# EAGLE design NQSMHS-V3 (EAGLE 7.7.0)

## Sheet 1 of 4
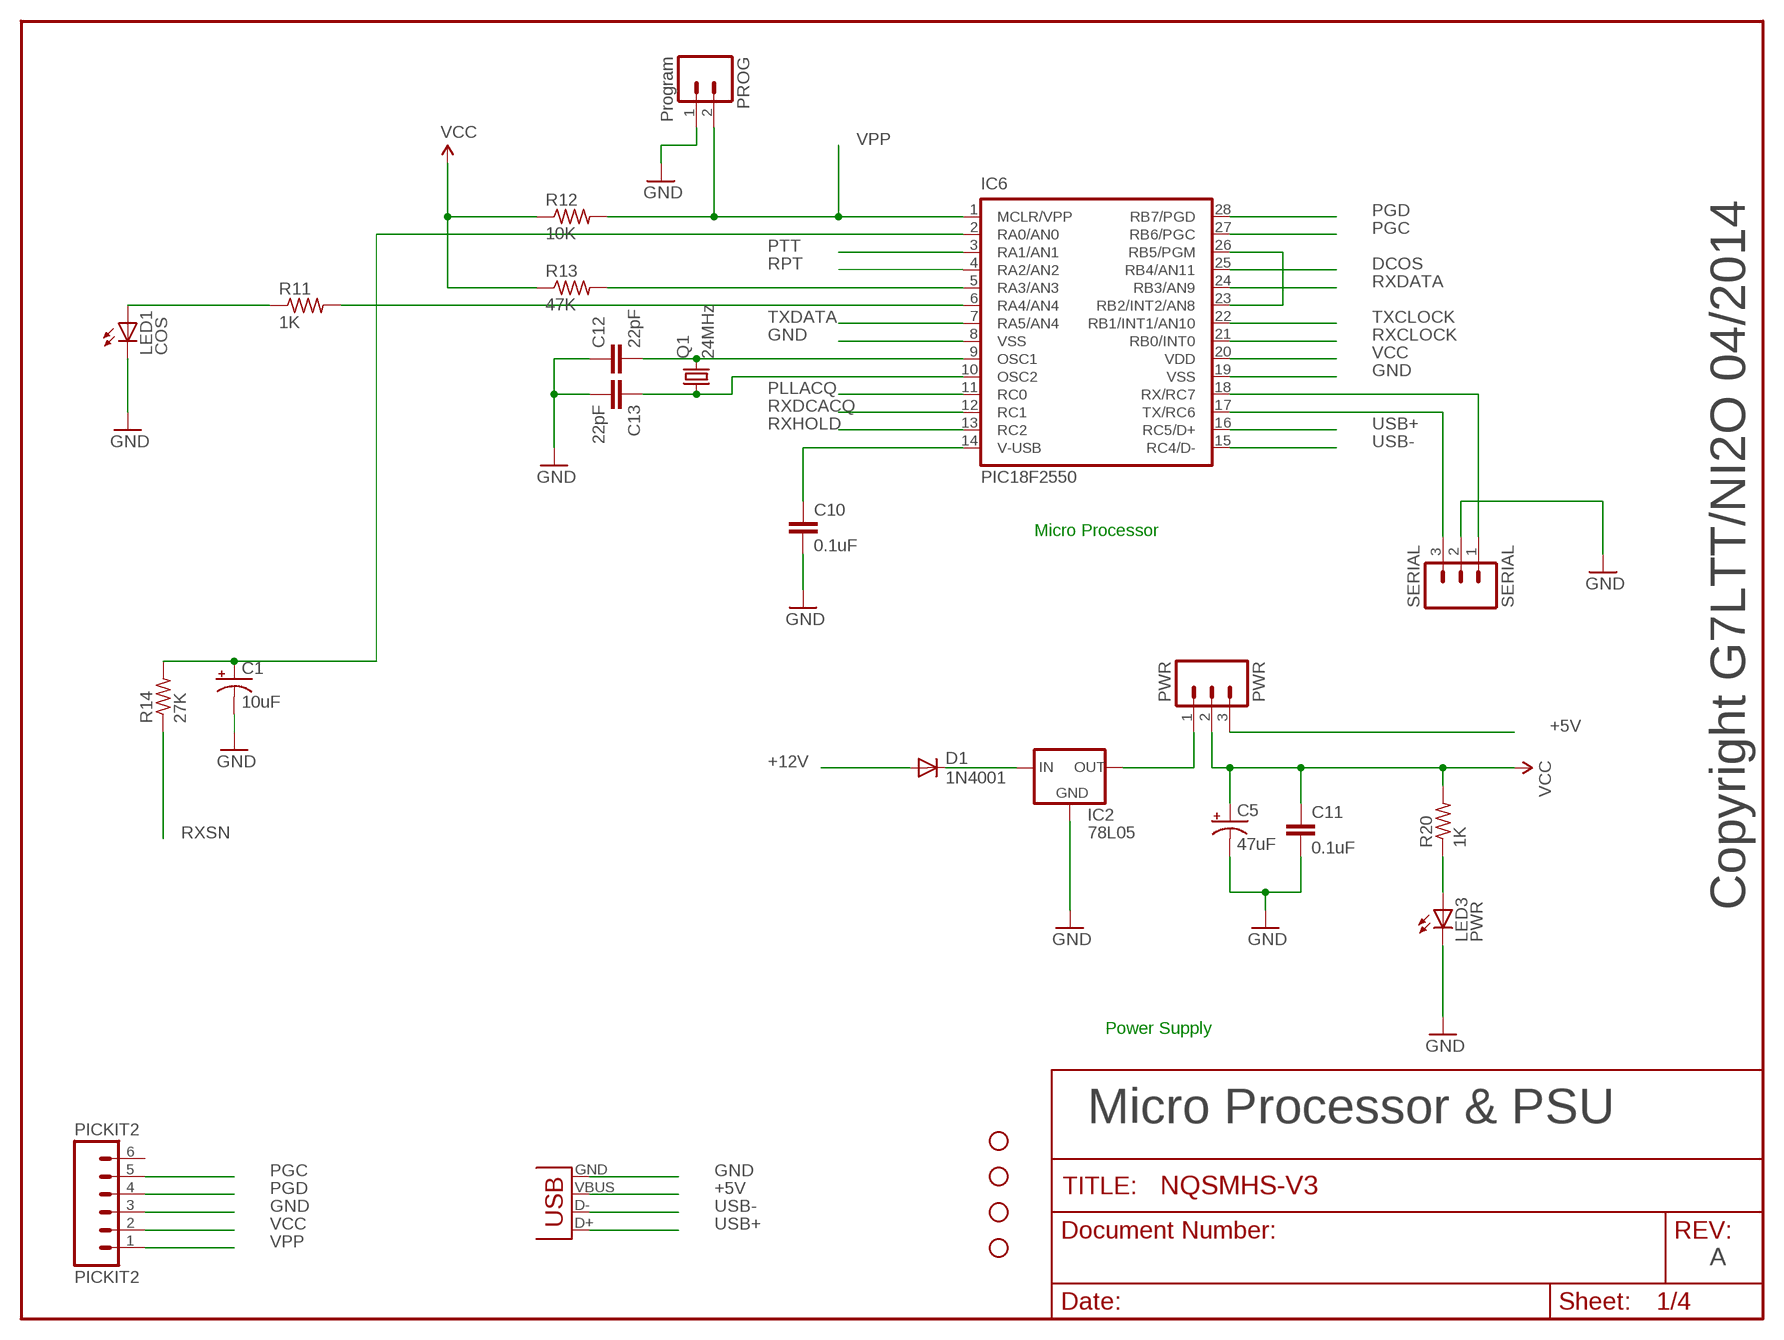
[diagram p0: schematic, sheet 1]

### Parts
C1  10uF  CAP_POLPTH2  [CPOL-RADIAL-10UF-25V]
C5  47uF  CAP_POLPTH2  [CPOL-RADIAL-10UF-25V]
C10  0.1uF  C2.5/2  [C2.5-2]
C11  0.1uF  C2.5/2  [C2.5-2]
C12  22pF  C2.5/2  [C2.5-2]
C13  22pF  C2.5/2  [C2.5-2]
D1  1N4001  DIODEPTH  [DIODE-1N4001]
IC2  78L05  78LXX  [78LXX]
IC6  PIC18F2550  [DIL28-3]
J1  USBPTH  [USB-B-PTH]
JP7  STAND-OFF  [STAND-OFF]
JP8  STAND-OFF  [STAND-OFF]
JP9  STAND-OFF  [STAND-OFF]
JP10  STAND-OFF  [STAND-OFF]
LED1  COS  LED3MM  [LED3MM]
LED3  PWR  LED3MM  [LED3MM]
PICKIT2  PICKIT2  M06SIP  [1X06]
PROG  Program  M02PTH  [1X02]
PWR  PWR  M03PTH  [1X03]
Q1  24MHz  CRYSTALHC49US  [HC49US]
R11  1K  R-US_0207/2V  [0207/2V]
R12  10K  R-US_0207/2V  [0207/2V]
R13  47K  R-US_0207/2V  [0207/2V]
R14  27K  R-US_0207/2V  [0207/2V]
R20  1K  R-US_0207/2V  [0207/2V]
SERIAL  SERIAL  M03PTH  [1X03]

### Nets
+5V: J1.VBUS PWR.3
+12V: D1.A ; also sheet 2
DCOS: IC6.25(RB4/AN11) ; also sheet 3
GND: C1.2(-) C5.2(-) C10.2 C11.2 C12.1 C13.2 IC2.GND IC6.8(VSS) IC6.19(VSS) J1.GND LED1.K(C) LED3.K(C) PICKIT2.3 PROG.1 SERIAL.2 ; also sheet 2,3,4
N$2: D1.C IC2.IN
N$3: IC6.23(RB2/INT2/AN8) IC6.26(RB5/PGM)
N$4: IC6.5(RA3/AN3) R13.2
N$5: IC6.6(RA4/AN4) R11.2
N$6: LED1.A R11.1
N$9: C12.2 IC6.9(OSC1) Q1.2
N$10: C13.1 IC6.10(OSC2) Q1.1
N$11: C10.1 IC6.14(V-USB)
N$12: IC2.OUT PWR.1
N$13: LED3.A R20.1
PGC: IC6.27(RB6/PGC) PICKIT2.5
PGD: IC6.28(RB7/PGD) PICKIT2.4
PLLACQ: IC6.11(RC0) ; also sheet 4
PTT: IC6.3(RA1/AN1) ; also sheet 2
RPT: IC6.4(RA2/AN2)
RX-232: IC6.18(RX/RC7) SERIAL.1
RXCLOCK: IC6.21(RB0/INT0) ; also sheet 4
RXDATA: IC6.24(RB3/AN9) ; also sheet 4
RXDCACQ: IC6.12(RC1) ; also sheet 4
RXHOLD: IC6.13(RC2) ; also sheet 4
RXSN: R14.1 ; also sheet 3,4
TX-232: IC6.17(TX/RC6) SERIAL.3
TX/SN: C1.1(+) IC6.2(RA0/AN0) R14.2
TXCLOCK: IC6.22(RB1/INT1/AN10) ; also sheet 4
TXDATA: IC6.7(RA5/AN4) ; also sheet 4
USB+: IC6.16(RC5/D+) J1.D+
USB-: IC6.15(RC4/D-) J1.D-
VCC: C5.1(+) C11.1 IC6.20(VDD) PICKIT2.2 PWR.2 R12.1 R13.1 R20.2 ; also sheet 2,3,4
VPP: IC6.1(MCLR/VPP) PICKIT2.1 PROG.2 R12.2
Unconnected: PICKIT2.6

### Notes on the sheet
- Micro Processor
- Copyright G7LTT/NI2O 04/2014
- Power Supply
- Micro Processor & PSU
- A

## Sheet 2 of 4
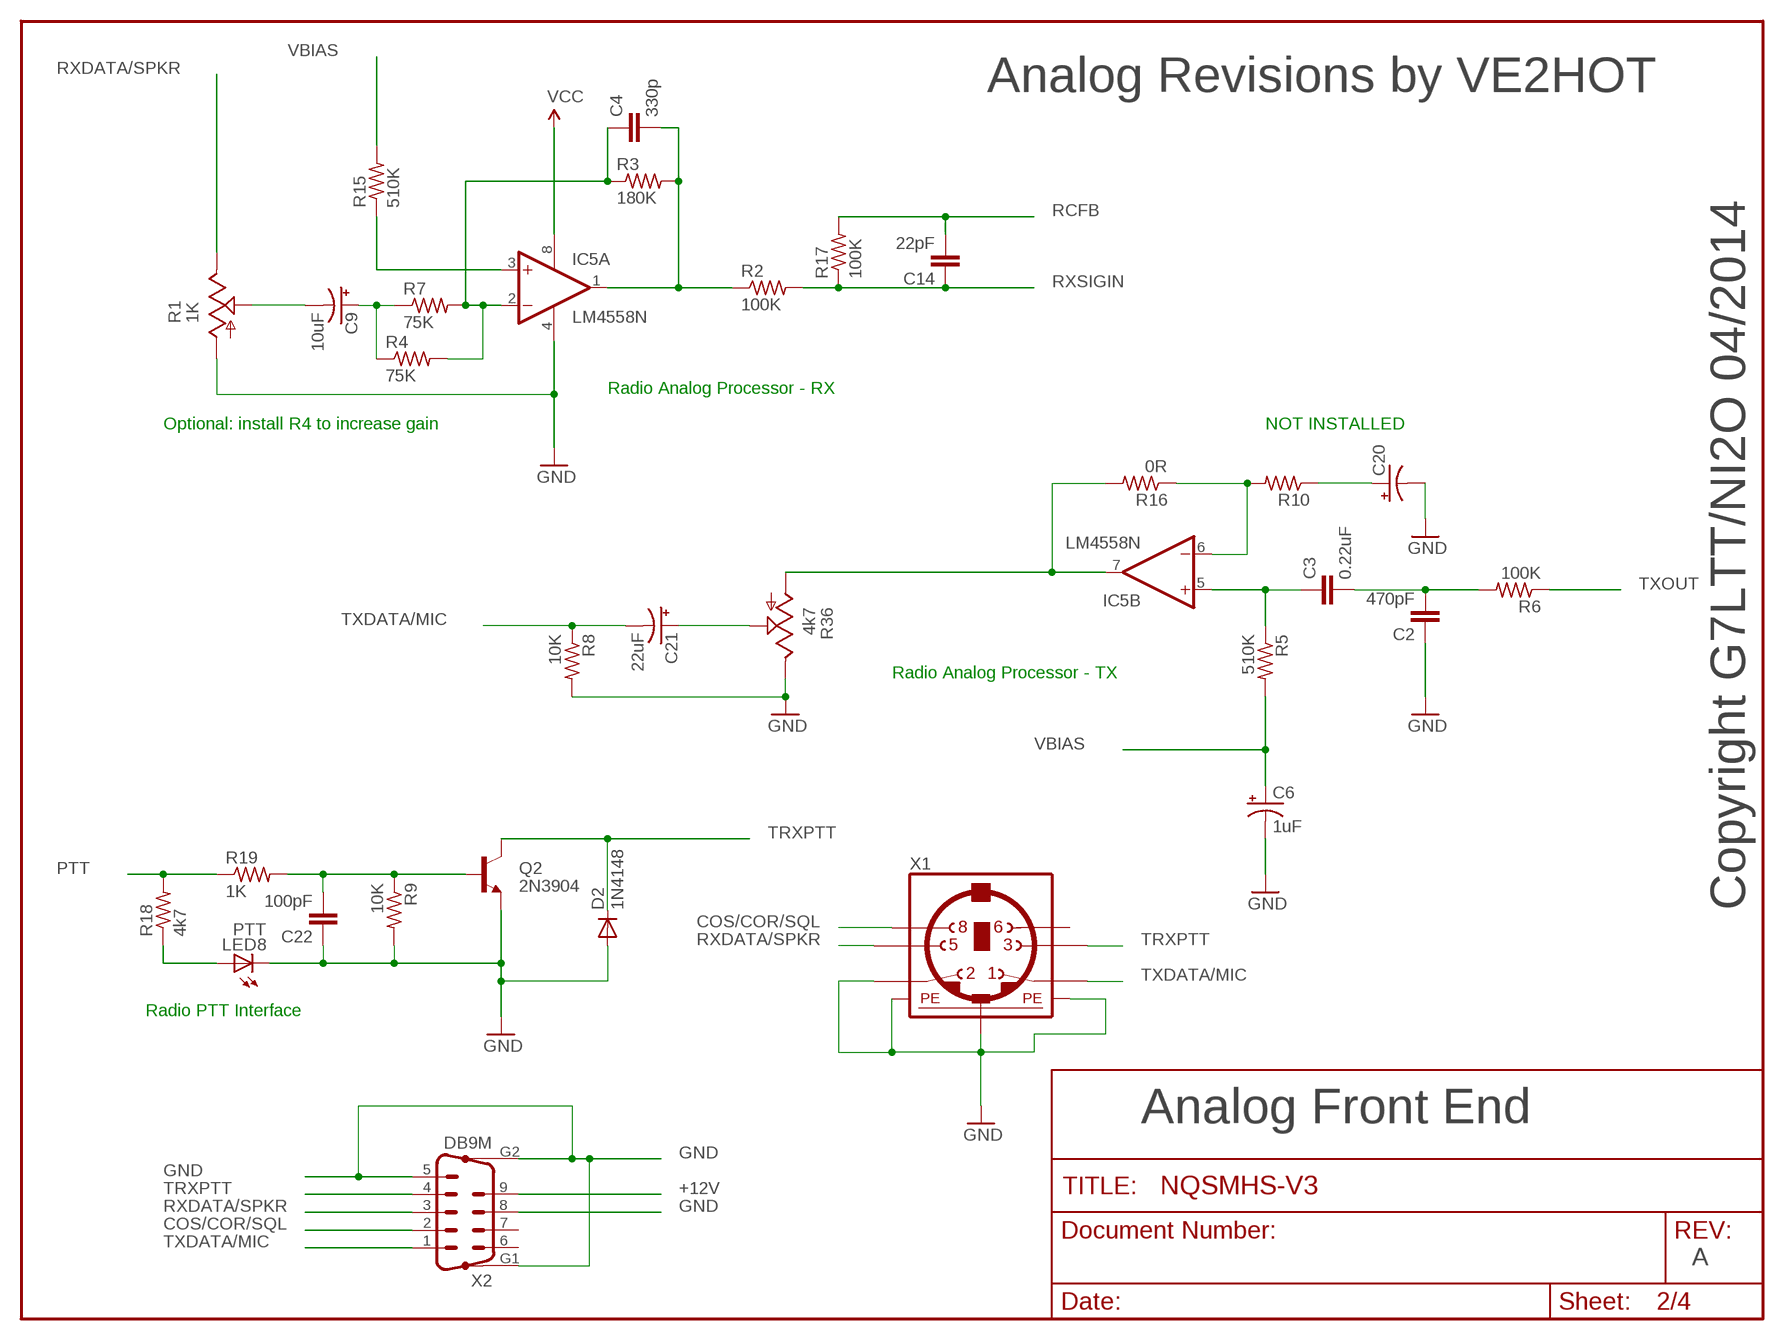
[diagram p1: schematic, sheet 2]

### Parts
C2  470pF  C2.5/2  [C2.5-2]
C3  0.22uF  C2.5/2  [C2.5-2]
C4  330p  C2.5/2  [C2.5-2]
C6  1uF  CAP_POLPTH2  [CPOL-RADIAL-10UF-25V]
C9  10uF  CAP_POLPTH2  [CPOL-RADIAL-10UF-25V]
C14  22pF  C2.5/2  [C2.5-2]
C20  CAP_POLPTH2  [CPOL-RADIAL-10UF-25V]
C21  22uF  CAP_POLPTH2  [CPOL-RADIAL-10UF-25V]
C22  100pF  C2.5/2  [C2.5-2]
D2  1N4148  [DO35-10]
IC5  LM4558N  [DIL08]
LED8  PTT  LED3MM  [LED3MM]
Q2  2N3904  TRANSISTOR_NPNTO92  [TO-92]
R1  1K  TRIM_US-CA6V  [CA6V]
R2  100K  R-US_0207/2V  [0207/2V]
R3  180K  R-US_0207/2V  [0207/2V]
R4  75K  R-US_0207/2V  [0207/2V]
R5  510K  R-US_0207/2V  [0207/2V]
R6  100K  R-US_0207/2V  [0207/2V]
R7  75K  R-US_0207/2V  [0207/2V]
R8  10K  R-US_0207/2V  [0207/2V]
R9  10K  R-US_0207/2V  [0207/2V]
R10  R-US_0207/2V  [0207/2V]
R15  510K  R-US_0207/2V  [0207/2V]
R16  0R  R-US_0207/2V  [0207/2V]
R17  100K  R-US_0207/2V  [0207/2V]
R18  4k7  R-US_0207/2V  [0207/2V]
R19  1K  R-US_0207/2V  [0207/2V]
R36  4k7  TRIM_US-CA6V  [CA6V]
X1  MINI_DIN_6  [M_DIN6]
X2  DB9M  M09HP  [M09HP]

### Nets
+12V: X2.9 ; also sheet 1
COS/COR/SQL: X1.8 X2.2
GND: C2.1 C6.2(-) C20.2(-) C22.1 D2.A IC5.4(P:V-) LED8.K(C) Q2.1(E) R1.A R8.2 R9.2 R36.E X1.2 X1.SH1(PE1) X1.SH2(PE2) X1.SH3(PE3) X2.5 X2.8 X2.G1 X2.G2 ; also sheet 1,3,4
N$8: C2.2 C3.2 R6.2
N$15: C22.2 Q2.2(B) R9.1 R19.2
N$17: LED8.A R18.1
N$18: C9.2(-) R1.S
N$19: IC5.7(B:OUT) R16.2 R36.A
N$20: C9.1(+) R4.1 R7.1
N$23: C4.2 IC5.1(A:OUT) R2.1 R3.2
N$25: C3.1 IC5.5(B:+IN) R5.1
N$26: C4.1 IC5.2(A:-IN) R3.1 R4.2 R7.2
N$27: IC5.6(B:-IN) R10.2 R16.1
N$28: C20.1(+) R10.1
N$29: C21.1(+) R36.S
N$40: IC5.3(A:+IN) R15.1
PTT: R18.2 R19.1 ; also sheet 1
RCFB: C14.2 R17.2 ; also sheet 4
RXDATA/SPKR: R1.E X1.5 X2.3
RXSIGIN: C14.1 R2.2 R17.1 ; also sheet 4
TRXPTT: D2.C Q2.3(C) X1.3 X2.4
TXDATA/MIC: C21.2(-) R8.1 X1.1 X2.1
TXOUT: R6.1 ; also sheet 4
VBIAS: C6.1(+) R5.2 R15.2 ; also sheet 4
VCC: IC5.8(P:V+) ; also sheet 1,3,4
Unconnected: X1.6 X2.6 X2.7

### Notes on the sheet
- Analog Revisions by VE2HOT
- Radio Analog Processor - RX
- Optional: install R4 to increase gain | NOT INSTALLED
- Radio Analog Processor - TX
- Copyright G7LTT/NI2O 04/2014
- Radio PTT Interface
- Analog Front End
- A

## Sheet 3 of 4
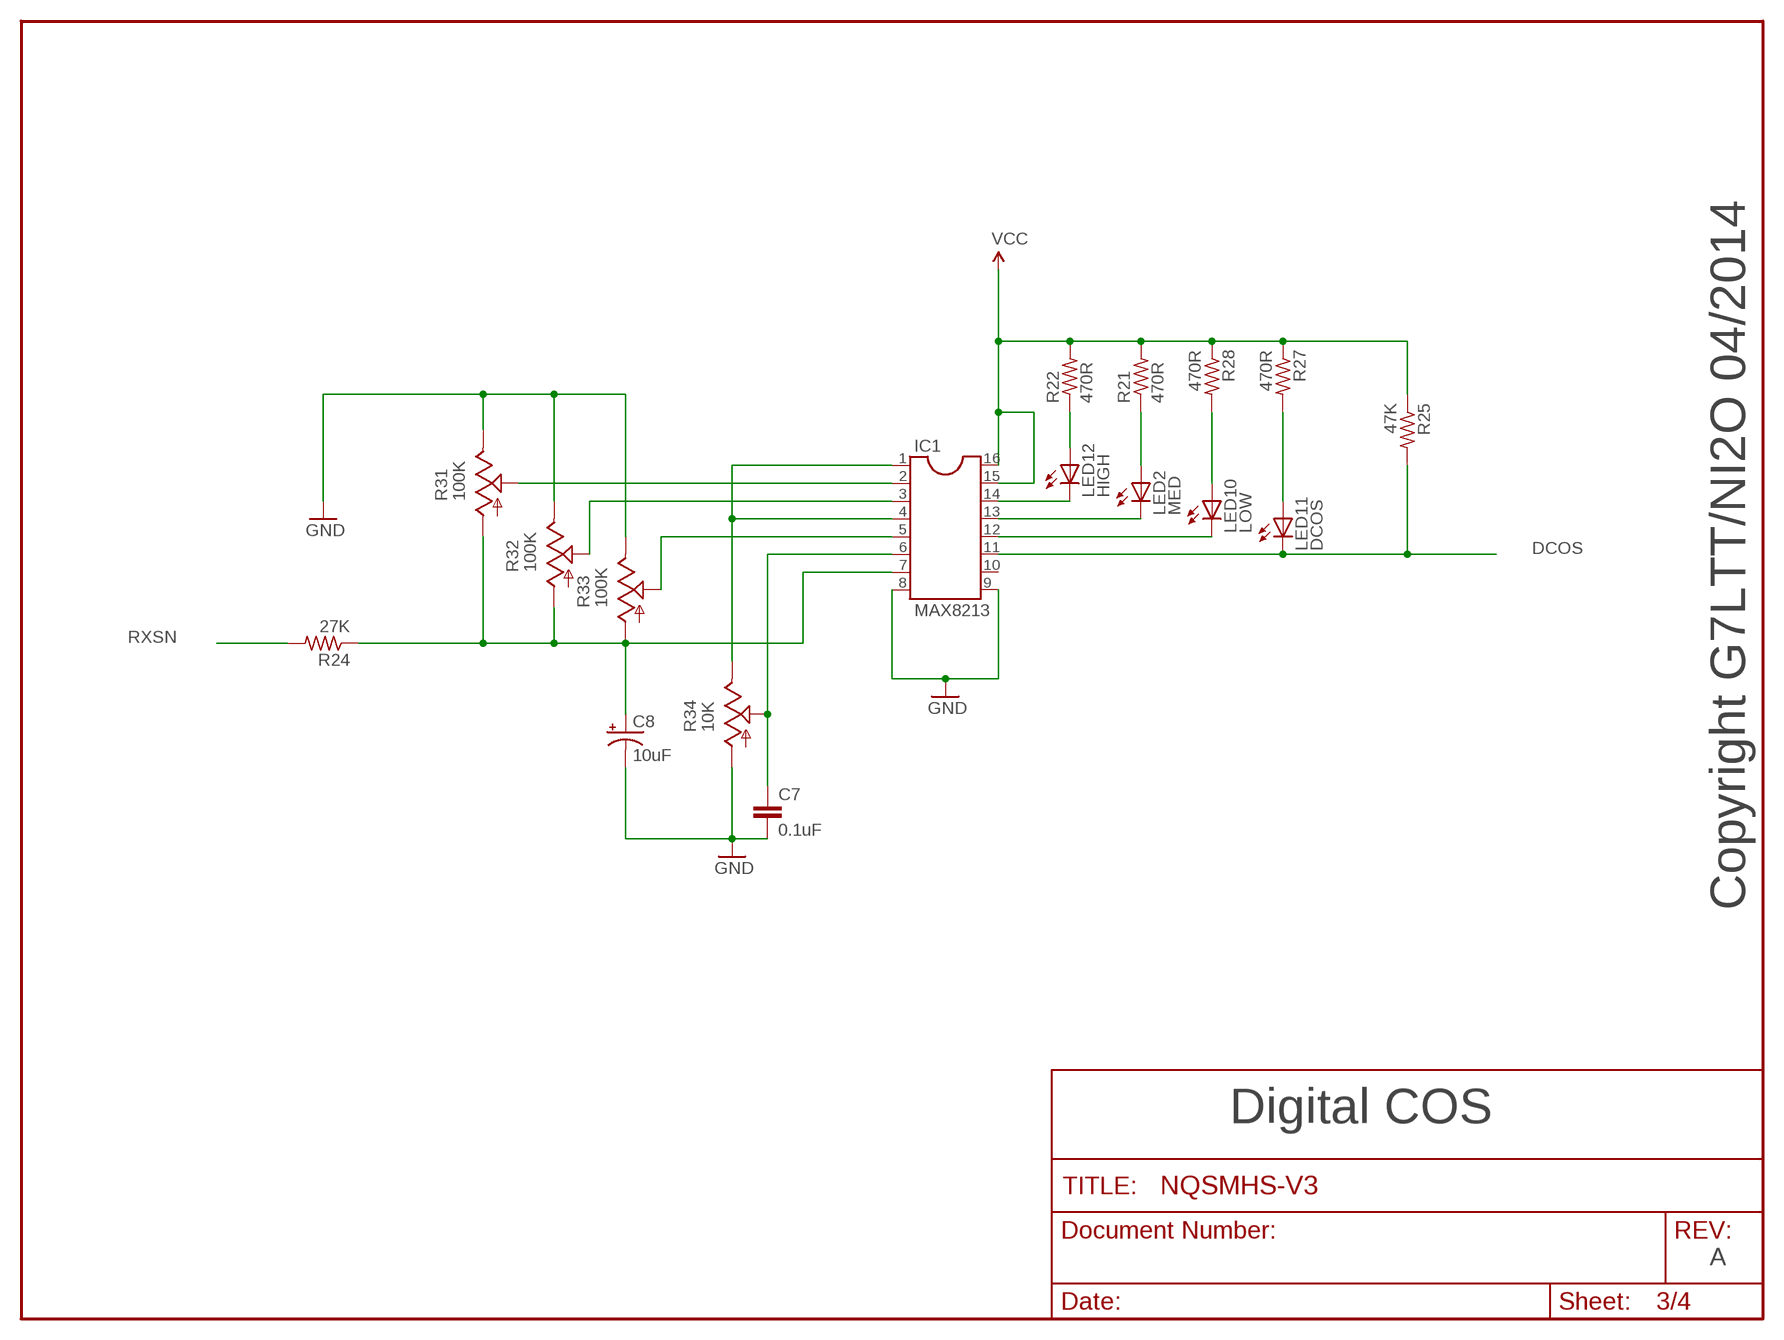
[diagram p2: schematic, sheet 3]

### Parts
C7  0.1uF  C2.5/2  [C2.5-2]
C8  10uF  CAP_POLPTH2  [CPOL-RADIAL-10UF-25V]
IC1  MAX8213  DIL16  [DIL16]
LED2  MED  LED3MM  [LED3MM]
LED10  LOW  LED3MM  [LED3MM]
LED11  DCOS  LED3MM  [LED3MM]
LED12  HIGH  LED3MM  [LED3MM]
R21  470R  R-US_0207/2V  [0207/2V]
R22  470R  R-US_0207/2V  [0207/2V]
R24  27K  R-US_0207/2V  [0207/2V]
R25  47K  R-US_0207/2V  [0207/2V]
R27  470R  R-US_0207/2V  [0207/2V]
R28  470R  R-US_0207/2V  [0207/2V]
R31  100K  TRIM_US-CA6V  [CA6V]
R32  100K  TRIM_US-CA6V  [CA6V]
R33  100K  TRIM_US-CA6V  [CA6V]
R34  10K  TRIM_US-CA6V  [CA6V]

### Nets
DCOS: IC1.11 LED11.K(C) R25.2 ; also sheet 1
GND: C7.2 C8.2(-) IC1.8 IC1.9 R31.E R32.E R33.E R34.A ; also sheet 1,2,4
N$14: C7.1 IC1.6 R34.S
N$16: IC1.14 LED12.K(C)
N$41: LED12.A R22.1
N$44: IC1.13 LED2.K(C)
N$45: LED2.A R21.1
N$46: IC1.12 LED10.K(C)
N$47: LED11.A R27.2
N$48: LED10.A R28.2
N$49: IC1.2 R31.S
N$50: IC1.3 R32.S
N$51: IC1.5 R33.S
N$52: IC1.1 IC1.4 R34.E
N$53: C8.1(+) IC1.7 R24.1 R31.A R32.A R33.A
RXSN: R24.2 ; also sheet 1,4
VCC: IC1.15 IC1.16 R21.2 R22.2 R25.1 R27.1 R28.1 ; also sheet 1,2,4
Unconnected: IC1.10

### Notes on the sheet
- Copyright G7LTT/NI2O 04/2014
- Digital COS
- A

## Sheet 4 of 4
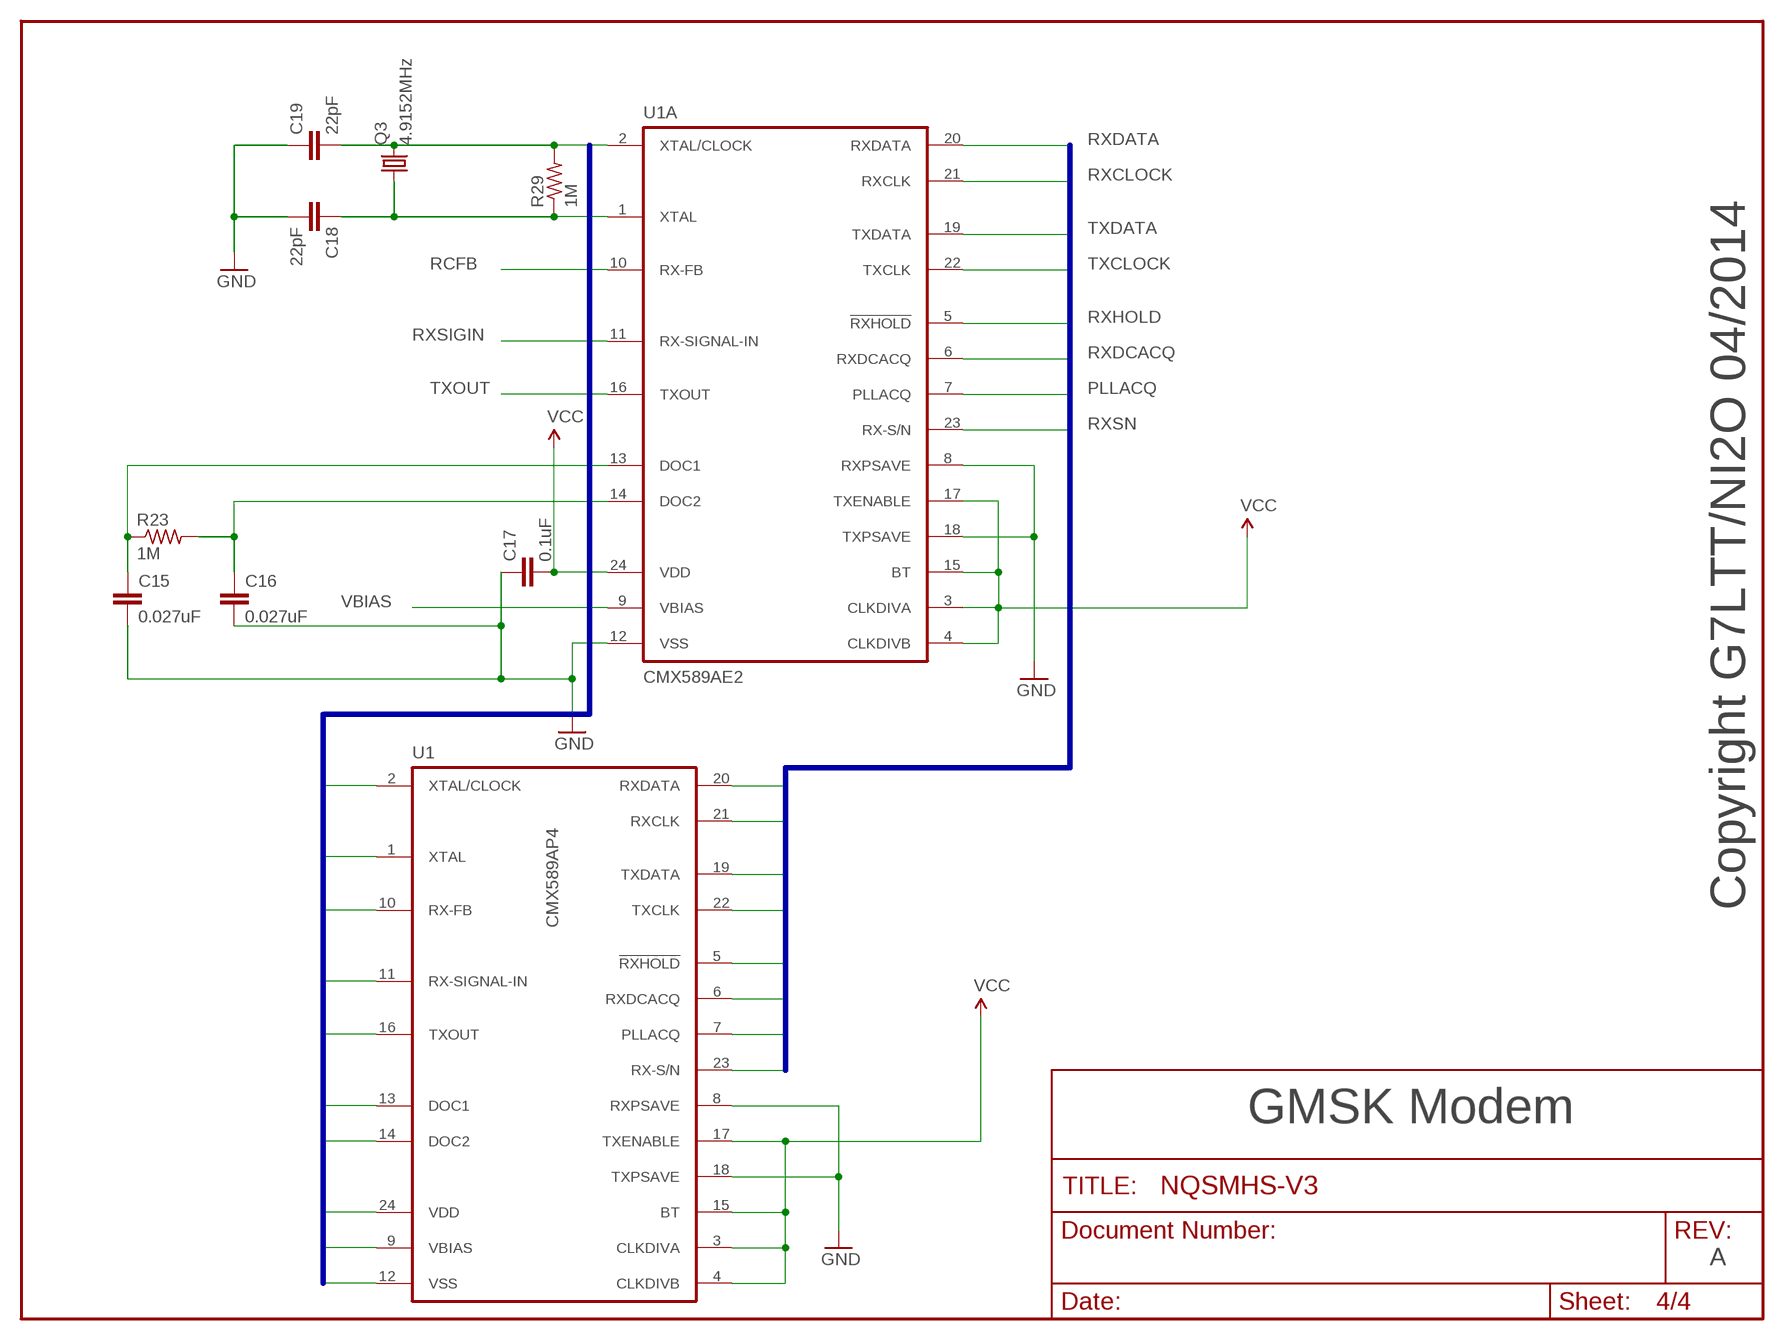
[diagram p3: schematic, sheet 4]

### Parts
C15  0.027uF  C2.5/2  [C2.5-2]
C16  0.027uF  C2.5/2  [C2.5-2]
C17  0.1uF  C2.5/2  [C2.5-2]
C18  22pF  C2.5/2  [C2.5-2]
C19  22pF  C2.5/2  [C2.5-2]
Q3  4.9152MHz  CRYSTALHC49US  [HC49US]
R23  1M  R-US_0207/2V  [0207/2V]
R29  1M  R-US_0207/2V  [0207/2V]
U1  CMX589AP4  [DIL24-6]
U1A  CMX589AE2  [TSSOP24]

### Nets
GND: C15.2 C16.2 C17.1 C18.2 C19.1 U1.8(RXPSAVE) U1.12(VSS) U1.18(TXPSAVE) U1A.8(RXPSAVE) U1A.12(VSS) U1A.18(TXPSAVE) ; also sheet 1,2,3
N$1: C15.1 R23.1 U1.13(DOC1) U1A.13(DOC1)
N$21: C16.1 R23.2 U1.14(DOC2) U1A.14(DOC2)
N$22: C18.1 Q3.1 R29.1 U1.1(XTAL) U1A.1(XTAL)
N$24: C19.2 Q3.2 R29.2 U1.2(XTAL/CLOCK) U1A.2(XTAL/CLOCK)
PLLACQ: U1.7(PLLACQ) U1A.7(PLLACQ) ; also sheet 1
RCFB: U1.10(RX-FB) U1A.10(RX-FB) ; also sheet 2
RXCLOCK: U1.21(RXCLK) U1A.21(RXCLK) ; also sheet 1
RXDATA: U1.20(RXDATA) U1A.20(RXDATA) ; also sheet 1
RXDCACQ: U1.6(RXDCACQ) U1A.6(RXDCACQ) ; also sheet 1
RXHOLD: U1.5(!RXHOLD!) U1A.5(!RXHOLD!) ; also sheet 1
RXSIGIN: U1.11(RX-SIGNAL-IN) U1A.11(RX-SIGNAL-IN) ; also sheet 2
RXSN: U1.23(RX-S/N) U1A.23(RX-S/N) ; also sheet 1,3
TXCLOCK: U1.22(TXCLK) U1A.22(TXCLK) ; also sheet 1
TXDATA: U1.19(TXDATA) U1A.19(TXDATA) ; also sheet 1
TXOUT: U1.16(TXOUT) U1A.16(TXOUT) ; also sheet 2
VBIAS: U1.9(VBIAS) U1A.9(VBIAS) ; also sheet 2
VCC: C17.2 U1.3(CLKDIVA) U1.4(CLKDIVB) U1.15(BT) U1.17(TXENABLE) U1.24(VDD) U1A.3(CLKDIVA) U1A.4(CLKDIVB) U1A.15(BT) U1A.17(TXENABLE) U1A.24(VDD) ; also sheet 1,2,3

### Buses
B$1
B$2

### Notes on the sheet
- Copyright G7LTT/NI2O 04/2014
- GMSK Modem
- A

## Library data of the parts
C1 C5 C6 C8 C9 C20 C21 = SparkFun:CAP_POL: Capacitor Polarized These are standard SMD and PTH capacitors. Normally 10uF, 47uF, and 100uF in electrolytic and tantalum varieties. Always verify the external diameter of the through hole cap, it varies with capacity, voltage, and manufacturer. The EIA devices should be standard.
C2-C4 C7 C10-C19 C22 = capacitor-wima:C: CAPACITOR naming: grid - package width
D1 = SparkFun:DIODE: Diode These are standard reverse protection diodes and small signal diodes. SMA package can handle up to about 1A. SOD-323 can handle about 200mA. What the SOD-323 package when ordering, there are some mfgs out there that are 5-pin packages.
D2 = diode-1:1N4148: DIODE high speed (Philips)
IC1 = ic-package:DIL16: Dual In Line / Socket
IC2 = v-reg:78LXX: VOLTAGE REGULATOR
IC5 = linear:*4558: OP AMP
IC6 = SparkFun:PIC18F2550
J1 = SparkFun:USB: USB Connectors USB-B-PTH is fully proven SKU : PRT-00139 USB-miniB is fully proven SKU : PRT-00587 USB-A-PCB is untested. USB-A-H is throughly reviewed, but untested. Spark Fun Electronics SKU : PRT-00437 USB-B-SMT is throughly reviewed, but untested. Needs silkscreen touching up. USB-A-S has not been used/tested USB-MB-H has not been used/tested
JP7-JP10 = SparkFun:STAND-OFF: Stand Off This is the mechanical footprint for a #4 phillips button head screw. Use the keepout ring to avoid running the screw head into surrounding components. SKU : PRT-00447
LED1-LED3 LED8 LED10-LED12 = SparkFun:LED: LEDs Standard schematic elements and footprints for 5mm, 3mm, 1206, and 0603 sized LEDs. 5mm - Spark Fun Electronics SKU : COM-00529 (and others)
PICKIT2 = SparkFun:M06: Header 6 Standard 6-pin 0.1" header. Use with straight break away headers (SKU : PRT-00116), right angle break away headers (PRT-00553), swiss pins (PRT-00743), machine pins (PRT-00117), and female headers (PRT-00115). Molex polarized connector foot print use with SKU : PRT-08094 with associated crimp pins and housings. NOTES ON THE VARIANTS LOCK and LOCK_LONGPADS... This footprint was designed to help hold the alignment of a through-hole component (i.e. 6-pin header) while soldering it into place. You may notice that each hole has been shifted either up or down by 0.005 of an inch from it's more standard position (which is a perfectly straight line). This slight alteration caused the pins (the squares in the middle) to touch the edges of the holes. Because they are alternating, it causes a "brace" to hold the component in place. 0.005 has proven to be the perfect amount of "off-center" position when using our standard breakaway headers. Although looks a little odd when you look at the bare footprint, once you have a header in there, the alteration is very hard to notice. Also, if you push a header all the way into place, it is covered up entirely on the bottom side. This idea of altering the position of holes to aid alignment will be further integrated into the Sparkfun Library for other footprints. It can help hold any component with 3 or more connection pins.
PROG = SparkFun:M02: Header 2 Standard 2-pin 0.1" header. Use with straight break away headers (SKU : PRT-00116), right angle break away headers (PRT-00553), swiss pins (PRT-00743), machine pins (PRT-00117), and female headers (PRT-00115). Molex polarized connector foot print use with SKU : PRT-08233 with associated crimp pins and housings.
PWR SERIAL = SparkFun:M03: Header 3 Standard 3-pin 0.1" header. Use with straight break away headers (SKU : PRT-00116), right angle break away headers (PRT-00553), swiss pins (PRT-00743), machine pins (PRT-00117), and female headers (PRT-00115). Molex polarized connector foot print use with SKU : PRT-08232 with associated crimp pins and housings.
Q1 Q3 = SparkFun:CRYSTAL: Crystals Various standard crystals. Proven footprints. Spark Fun Electronics SKU : COM-00534
Q2 = SparkFun:TRANSISTOR_NPN: Transistor NPN BJT configuration in SOT23 package. MMBT2222 is the common NPN we use. Double check BCE configuration again layout.
R1 R31-R34 R36 = pot:TRIM_US-: POTENTIOMETER
R2-R25 R27-R29 = resistor:R-US_: RESISTOR, American symbol
U1 U1A = cml-micro:CMX589A: HIGH-SPEED GMSK MODEM
X1 = mini_din:MINI_DIN_6
X2 = con-subd:M09HP: SUB-D

## Board
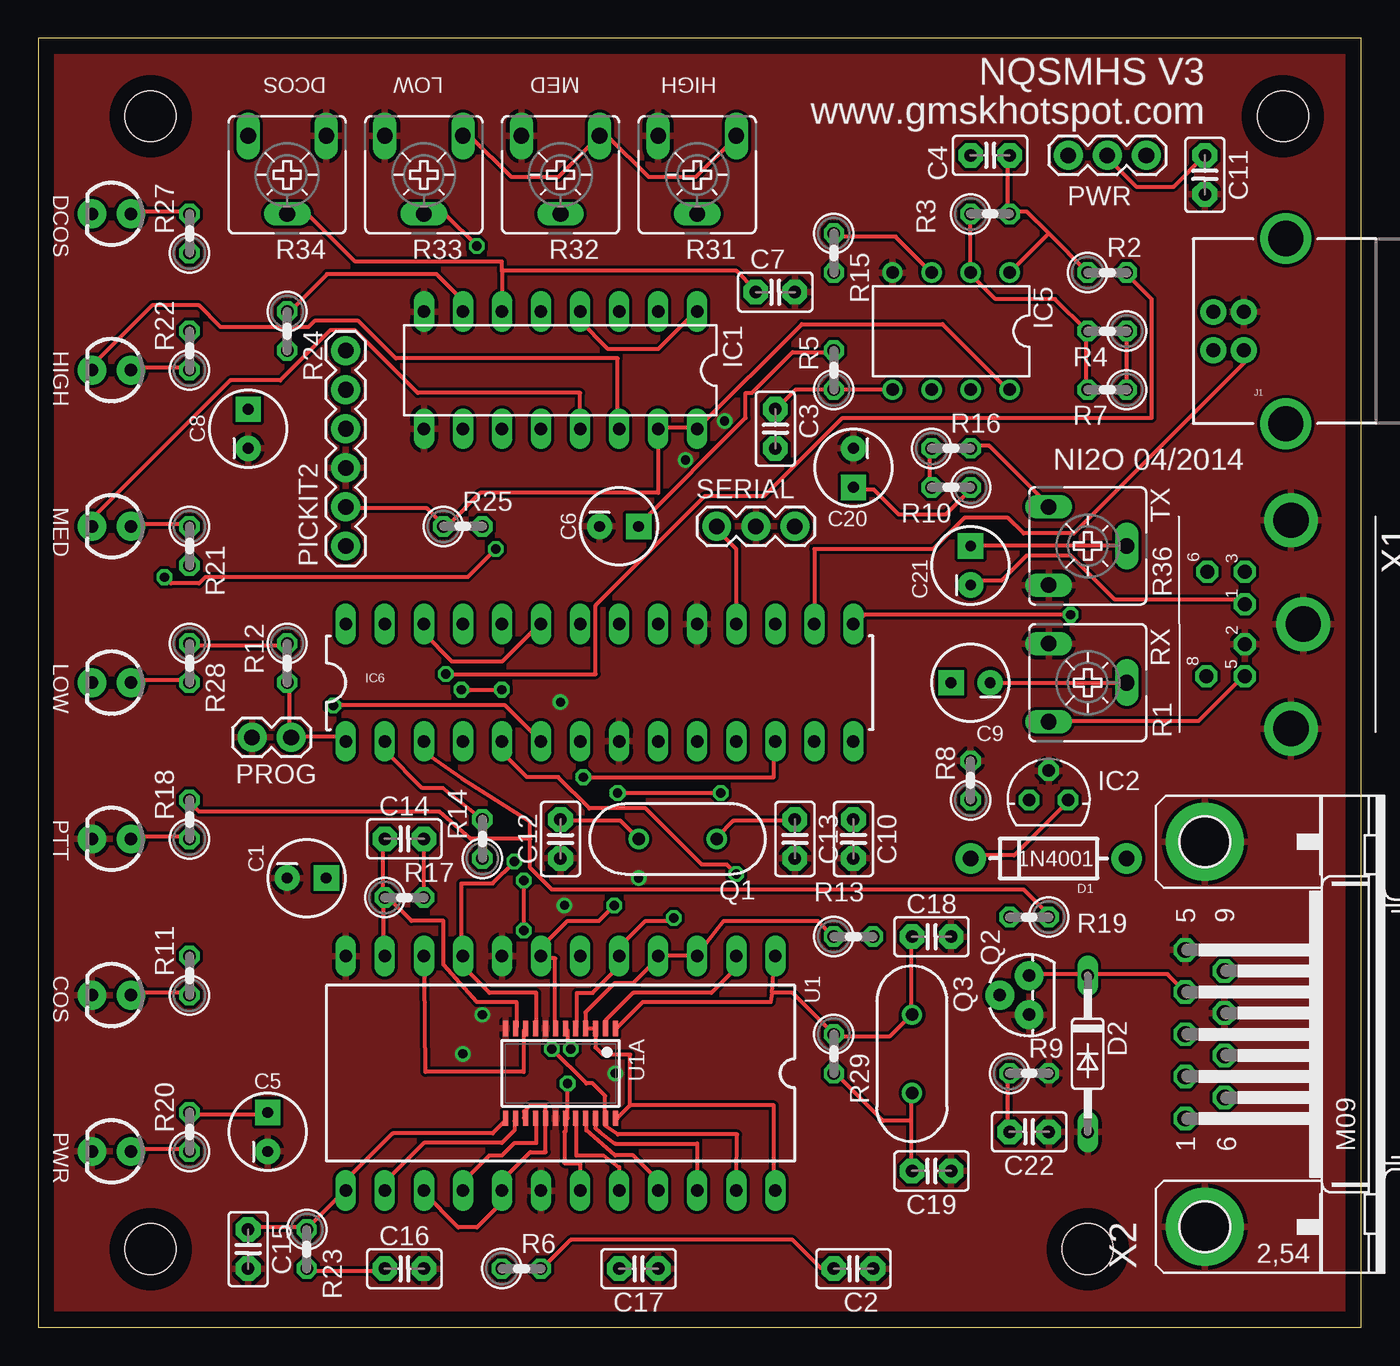
[diagram p4: board, top side]
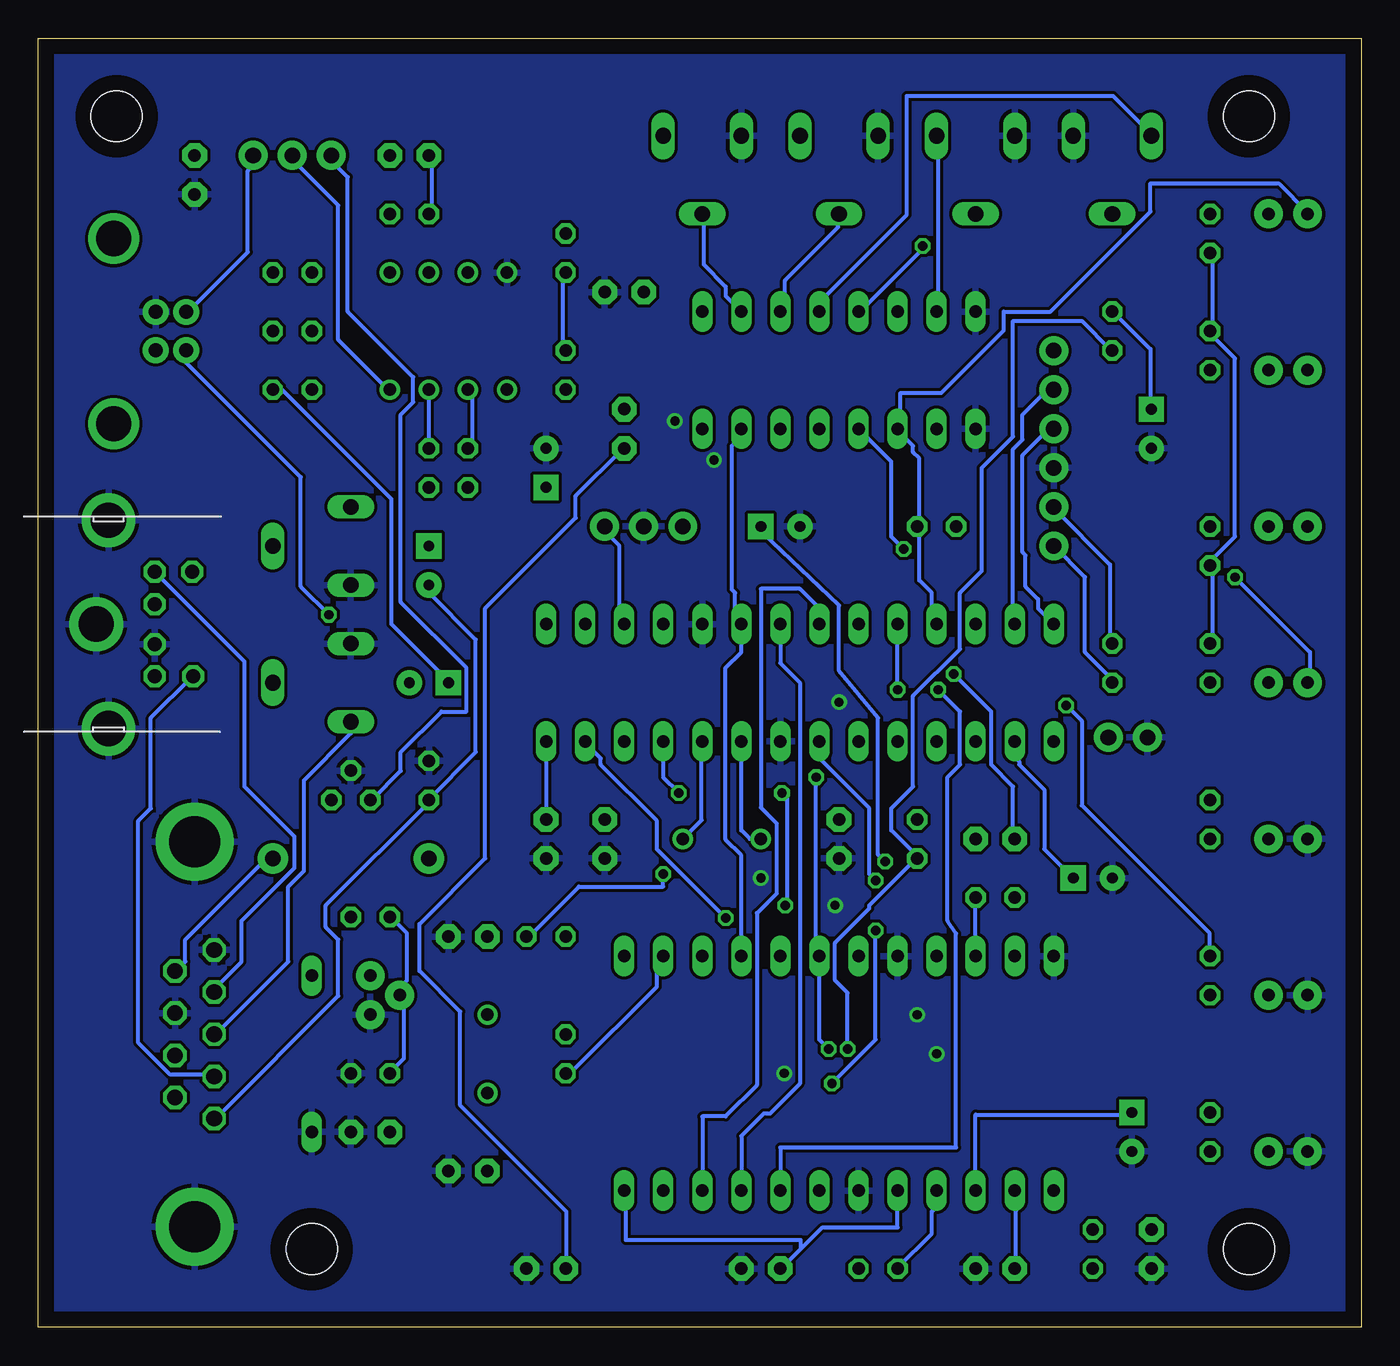
[diagram p5: board, bottom side, seen from below]

Size 86.03 x 83.8 mm. Coordinates in mm from the lower left corner, seen from the top.
Outline: 86.03,0 86.03,83.8 0,83.8 0,0 86.03,0
Copper layers (1*16): Top 0.035mm / dielectric 1.5mm / Bottom 0.035mm
Design rules "default": minimum track width 10mil, minimum drill 24mil, track to track 8mil, track to pad 8mil, pad to pad 8mil, via to via 8mil, smd to smd 8mil, copper to edge 40mil, drill to drill 8mil, minimum pad ring 10mil, minimum via ring 8mil, stop-mask expansion 4mil, vias tented up to drill 0mil, thermal gap 10mil

### Footprints (pad centres in the part's own frame; a part is rotated, then mirrored left to right if it is on the bottom)
CPOL-RADIAL-10UF-25V = drill 0.7 pad 1.651 square: 1 1.27,0 | drill 0.7 pad 1.651: 2 -1.27,0
C2.5-2 = drill 0.813 pad 1.6 octagon: 1 -1.27,0; 2 1.27,0
DIODE-1N4001 = drill 1 pad 1.981: A -5.08,0; C 5.08,0
DO35-10 = drill 0.813 long: A 5.08,0; C -5.08,0
DIL16 = drill 0.813 long: 1 -8.89,-3.81; 2 -6.35,-3.81; 3 -3.81,-3.81; 4 -1.27,-3.81; 5 1.27,-3.81; 6 3.81,-3.81; 7 6.35,-3.81; 8 8.89,-3.81; 9 8.89,3.81; 10 6.35,3.81; 11 3.81,3.81; 12 1.27,3.81; 13 -1.27,3.81; 14 -3.81,3.81; 15 -6.35,3.81; 16 -8.89,3.81
78LXX = drill 0.813 octagon: GND 0,1.905; IN 1.27,0; OUT -1.27,0
DIL08 = drill 0.813 pad 1.27: 1 -3.81,-3.81; 2 -1.27,-3.81; 3 1.27,-3.81; 4 3.81,-3.81; 5 3.81,3.81; 6 1.27,3.81; 7 -1.27,3.81; 8 -3.81,3.81
DIL28-3 = drill 0.813 long: 1 -16.51,-3.81; 2 -13.97,-3.81; 3 -11.43,-3.81; 4 -8.89,-3.81; 5 -6.35,-3.81; 6 -3.81,-3.81; 7 -1.27,-3.81; 8 1.27,-3.81; 9 3.81,-3.81; 10 6.35,-3.81; 11 8.89,-3.81; 12 11.43,-3.81; 13 13.97,-3.81; 14 16.51,-3.81; 15 16.51,3.81; 16 13.97,3.81; 17 11.43,3.81; 18 8.89,3.81; 19 6.35,3.81; 20 3.81,3.81; 21 1.27,3.81; 22 -1.27,3.81; 23 -3.81,3.81; 24 -6.35,3.81; 25 -8.89,3.81; 26 -11.43,3.81; 27 -13.97,3.81; 28 -16.51,3.81
USB-B-PTH = drill 0.914 pad 1.676: D+ 0,1.25; D- 1.981,1.25; GND 0,-1.25; VBUS 1.981,-1.25 | drill 2.286: P$1 -2.718,-6.02; P$2 -2.718,6.02
STAND-OFF = hole 3.302: 0,0
LED3MM = drill 0.813 pad 1.88: A -1.27,0; K 1.27,0
1X06 = drill 1.016 pad 1.88: 1 0,0; 2 2.54,0; 3 5.08,0; 4 7.62,0; 5 10.16,0; 6 12.7,0
1X02 = drill 1.016 pad 1.88: 1 0,0; 2 2.54,0
1X03 = drill 1.016 pad 1.88: 1 0,0; 2 2.54,0; 3 5.08,0
HC49US = drill 0.813: 1 -2.54,0; 2 2.54,0
TO-92 = drill 0.813 pad 1.88: 1 -1.27,0; 2 0,1.905; 3 1.27,0
CA6V = drill 1.016 long: A -2.54,-2.54; E 2.54,-2.54; S 0,2.54
0207/2V = drill 0.813 octagon: 1 -1.27,0; 2 1.27,0
DIL24-6 = drill 0.813 long: 1 -13.97,-7.62; 2 -11.43,-7.62; 3 -8.89,-7.62; 4 -6.35,-7.62; 5 -3.81,-7.62; 6 -1.27,-7.62; 7 1.27,-7.62; 8 3.81,-7.62; 9 6.35,-7.62; 10 8.89,-7.62; 11 11.43,-7.62; 12 13.97,-7.62; 13 13.97,7.62; 14 11.43,7.62; 15 8.89,7.62; 16 6.35,7.62; 17 3.81,7.62; 18 1.27,7.62; 19 -1.27,7.62; 20 -3.81,7.62; 21 -6.35,7.62; 22 -8.89,7.62; 23 -11.43,7.62; 24 -13.97,7.62
TSSOP24 = smd 0.305 x 0.991: 1 -3.575,-2.918; 2 -2.925,-2.918; 3 -2.275,-2.918; 4 -1.625,-2.918; 5 -0.975,-2.918; 6 -0.325,-2.918; 7 0.325,-2.918; 8 0.975,-2.918; 9 1.625,-2.918; 10 2.275,-2.918; 11 2.925,-2.918; 12 3.575,-2.918; 13 3.575,2.918; 14 2.925,2.918; 15 2.275,2.918; 16 1.625,2.918; 17 0.975,2.918; 18 0.325,2.918; 19 -0.325,2.918; 20 -0.975,2.918; 21 -1.625,2.918; 22 -2.275,2.918; 23 -2.925,2.918; 24 -3.575,2.918
M_DIN6 = drill 0.9 pad 1.422 octagon: 1 -1.3,-3.75; 2 1.3,-3.75; 3 -3.4,-3.75; 5 3.4,-3.75; 6 -3.4,-6.2; 8 3.4,-6.25 | drill 2.3 pad 3.5: SH1 6.8,-0.75; SH2 0,0.05; SH3 -6.75,-0.75
M09HP = drill 1.016 octagon: 1 -5.486,1.27; 2 -2.743,1.27; 3 0,1.27; 4 2.743,1.27; 5 5.486,1.27; 6 -4.115,-1.27; 7 -1.372,-1.27; 8 1.372,-1.27; 9 4.115,-1.27 | drill 3.302 pad 5.08: G1 -12.522,0; G2 12.522,0

### Placement (x,y rotation side)
C1  17.45,29.21 0 top
C2  53.01,3.81 180 top
C3  47.93,58.42 270 top
C4  61.9,76.2 0 top
C5  14.91,12.7 90 top
C6  37.77,52.07 0 top
C7  47.93,67.31 0 top
C8  13.64,58.42 90 top
C9  60.63,41.91 180 top
C10  53.01,31.75 270 top
C11  75.87,74.93 270 top
C12  33.96,31.75 90 top
C13  49.2,31.75 270 top
C14  23.8,31.75 0 top
C15  13.64,5.08 270 top
C16  23.8,3.81 0 top
C17  39.04,3.81 180 top
C18  58.09,25.4 0 top
C19  58.09,10.16 180 top
C20  53.01,55.88 270 top
C21  60.63,49.53 90 top
C22  64.44,12.7 180 top
D1  65.71,30.48 180 top
D2  68.25,17.78 270 top
IC1  33.96,62.23 180 top
IC2  65.71,34.29 0 top
IC5  59.36,64.77 180 top
IC6  36.5,41.91 0 top
J1  78.41,64.77 180 top
JP7  68.25,5.08 90 top
JP8  80.95,78.74 90 top
JP9  7.29,5.08 90 top
JP10  7.29,78.74 90 top
LED1  4.75,21.59 180 top
LED2  4.75,52.07 180 top
LED3  4.75,11.43 180 top
LED8  4.75,31.75 180 top
LED10  4.75,41.91 180 top
LED11  4.75,72.39 180 top
LED12  4.75,62.23 180 top
PICKIT2  19.99,50.8 90 top
PROG  13.89,38.35 0 top
PWR  66.98,76.2 0 top
Q1  41.58,31.75 180 top
Q2  64.44,21.59 90 top
Q3  56.82,17.78 270 top
R1  68.25,41.91 270 top
R2  69.52,68.58 0 top
R3  61.9,72.39 0 top
R4  69.52,64.77 180 top
R5  51.74,62.23 90 top
R6  31.42,3.81 0 top
R7  69.52,60.96 180 top
R8  60.63,35.56 90 top
R9  64.44,16.51 0 top
R10  59.36,54.61 180 top
R11  9.83,22.86 90 top
R12  16.18,43.18 270 top
R13  53.01,25.4 0 top
R14  28.88,31.75 90 top
R15  51.74,69.85 270 top
R16  59.36,57.15 0 top
R17  23.8,27.94 0 top
R18  9.83,33.02 90 top
R19  64.44,26.67 180 top
R20  9.83,12.7 90 top
R21  9.83,50.8 270 top
R22  9.83,63.5 90 top
R23  17.45,5.08 270 top
R24  16.18,64.77 270 top
R25  27.61,52.07 0 top
R27  9.83,71.12 90 top
R28  9.83,43.18 270 top
R29  51.74,17.78 270 top
R31  42.85,74.93 180 top
R32  33.96,74.93 180 top
R33  25.07,74.93 180 top
R34  16.18,74.93 180 top
R36  68.25,50.8 270 top
SERIAL  44.12,52.07 0 top
U1  33.96,16.51 180 top
U1A  33.96,16.51 180 top
X1  82.22,45.72 270 top
X2  75.87,19.05 90 top

### Tracks (layer width: path | path; a pad name or v marks a point on that pad's centre or on a via)
+5V
  Bottom 0.254: J1.VBUS 76.28,66.04 72.42,69.9 72.42,75.18 72.21,75.39 72.21,76.2 PWR.3
+12V
  Bottom 0.254: D1.A 71.2,30.48 76.48,25.2 76.48,23.77 77.09,23.16 X2.9
COS/COR/SQL
  Bottom 0.254: X1.8 76.07,42.27 78.72,39.62 78.72,33.73 79.53,32.92 79.53,18.49 77.5,16.46 74.65,16.46 X2.2
DCOS
  Bottom 0.254: IC6.25 27.71,45.72 27.91,45.92 27.91,47.75 28.73,48.56 28.73,52.02 R25.2 28.73,52.22 28.73,56.49 29.13,56.9 29.13,57.3 29.95,58.12 | 29.95,58.12 30.15,58.32 IC1.11 29.95,58.12 | 29.95,58.12 29.95,60.76 27.3,60.76 23.24,64.82 23.24,66.04 20.19,66.04 13.69,72.54 13.69,74.37 5.36,74.37 3.53,72.54 LED11.K
GND  (via drill 0.6)
  other vias: 33.96,40.64 27.61,17.78 28.88,20.32 39.04,29.21 37.52,16.51 34.21,27.43 44.63,58.93 42.09,56.39
  pour Bottom: 86.03,0 86.03,83.82 -0.33,83.82 -0.33,0
  pour Top: 86.03,0 86.03,83.82 -0.33,83.82 -0.33,0
N$1
  Top 0.254: U1A.13 30.35,13.41 29.54,12.6 23.04,12.6 19.99,9.55 U1.13 19.99,8.74 19.79,8.74 17.55,6.5 R23.1 17.35,6.5 13.69,6.5 C15.1
N$2
  Top 0.254: D1.C 60.83,30.68 63.48,30.68 66.93,34.14 IC2.IN
N$3
  Top 0.254: IC6.26 25.07,45.11 26.9,43.28 30.15,43.28 32.59,45.72 IC6.23
N$4  (via drill 0.61)
  Top 0.254: v45.39,29.46 44.78,30.07 43.16,30.07 39.5,33.73 35.84,33.73 33.81,35.76 31.78,35.76 30.15,37.39 IC6.5
  Bottom 0.254: v45.39,29.46 45.39,28.65 50.88,28.65 54.13,25.4 R13.2
N$5  (via drill 0.61)
  Top 0.254: v19.18,40.44 30.35,40.44 IC6.6
  Bottom 0.254: v19.18,40.44 18.16,39.42 18.16,33.93 9.88,25.65 9.88,24.64 9.83,24.18 R11.2
N$6
  Top 0.254: R11.1 9.83,21.74 6.17,21.74 LED1.A
N$8
  Top 0.254: R6.2 32.79,3.86 34.62,5.69 49.05,5.69 50.88,3.86 51.69,3.86 C2.2
  Bottom 0.254: C3.2 48.03,57.1 51.08,54.05 51.08,52.63 56.97,46.74 56.97,30.48 61.24,26.21 61.24,23.16 58.6,20.52 58.6,14.43 51.69,7.52 51.69,3.86 C2.2
N$9
  Top 0.254: Q1.2 37.87,32.92 34.01,32.92 C12.2
  Bottom 0.254: IC6.9 40.31,32.31 39.75,31.75 Q1.2
N$10
  Top 0.254: Q1.1 44.17,31.9 45.19,32.92 49.05,32.92 C13.1
  Bottom 0.254: IC6.10 42.9,38.05 42.9,32.97 Q1.1
N$11
  Bottom 0.254: IC6.14 C10.1
N$12
  Bottom 0.254: IC2.OUT 64.29,34.34 62.46,36.17 62.46,37.39 59.82,40.03 58.19,40.03 58.19,42.88 62.46,47.14 62.46,59.33 61.65,60.15 61.65,61.77 65.91,66.04 65.91,74.78 66.93,75.79 66.93,76.2 PWR.1
N$13
  Top 0.254: R20.1 9.83,11.58 6.17,11.58 LED3.A
N$14
  Top 0.254: 30.15,68.68 30.15,69.29 20.6,69.29 17.55,72.34 16.33,72.34 R34.S | 30.15,68.68 IC1.6 | 30.15,68.68 45.39,68.68 46.61,67.46 C7.1
N$15
  Top 0.254: R9.1 63.07,16.46 63.07,12.8 C22.2
  Bottom 0.254: 62.26,22.35 62.46,22.15 62.46,21.74 Q2.2 62.26,22.35 | 62.26,22.35 62.05,22.55 62.05,25.6 63.07,26.62 R19.2 | 62.26,22.35 62.26,17.48 63.07,16.66 R9.1
N$16
  Top 0.254: IC1.14 37.67,58.52 37.67,62.99 23.24,62.99 20.8,65.43 17.96,65.43 17.55,65.02 11.86,65.02 10.44,66.45 7.39,66.45 3.33,62.38 LED12.K
N$17
  Top 0.254: R18.1 9.83,31.9 6.17,31.9 LED8.A
N$18
  Top 0.254: R1.S 70.79,41.86 62.05,41.86 C9.2
N$19
  Top 0.254: R36.A 65.71,53.44 61.85,57.3 60.63,57.3 R16.2
  Bottom 0.254: R16.2 IC5.7
N$20
  Top 0.254: R7.1 R4.1
  Bottom 0.254: R7.1 70.18,60.96 63.07,53.85 63.07,45.72 59.41,42.06 C9.1
N$21
  Top 0.254: R23.2 17.55,3.66 22.43,3.66 C16.1 | U1A.14 30.96,13.41 30.96,12.8 30.15,11.99 25.07,11.99 22.63,9.55 22.63,8.94 U1.14
  Bottom 0.254: C16.1 22.43,3.86 22.48,4.06 22.48,7.52 22.43,7.72 22.43,8.74 U1.14
N$22
  Top 0.254: 56.77,20.32 56.77,25.4 C18.1 | 47.73,21.74 47.83,23.37 47.83,23.98 U1.1 | 47.73,21.74 47.62,21.13 39.29,21.13 37.67,19.51 U1A.1 | 47.73,21.74 49.05,21.74 R29.1 51.89,18.9 55.35,18.9 56.77,20.32 | Q3.1 56.77,20.32
N$23
  Top 0.254: 65.71,71.12 64.29,72.54 63.27,72.54 R3.2 63.07,72.54 63.07,76.2 C4.2 | R2.1 65.71,71.12 | 65.71,71.12 IC5.1
N$24
  Top 0.254: U1A.2 36.86,19.51 36.86,19.91 38.68,21.74 43.76,21.74 45.39,23.37 U1.2 | 56.77,13.41 56.77,10.16 C19.2 | 56.77,13.41 56.77,15.24 Q3.2 | 56.77,13.41 54.94,13.41 51.89,16.46 R29.2
  Bottom 0.254: U1.2 45.39,23.98 45.8,23.57 45.8,22.15 51.28,16.66 51.69,16.66 R29.2
N$25
  Top 0.254: IC5.5 R5.1 49.25,60.96 48.03,59.74 C3.1
N$26
  Top 0.254: R7.2 68.15,60.96 68.15,64.62 R4.2 68.15,64.82 66.12,66.85 62.26,66.85 60.63,68.48 IC5.2 R3.1
  Bottom 0.254: C4.1 60.43,76 60.43,72.75 60.63,72.54 R3.1
N$27
  Top 0.254: R10.2 57.99,54.66 57.99,57.1 R16.1
  Bottom 0.254: IC5.6 57.99,60.96 57.78,60.76 57.78,57.51 57.99,57.3 R16.1
N$28
  Top 0.254: R10.1 60.63,54.46 59,52.83 55.96,52.83 54.33,54.46 53.11,54.46 C20.1
N$29
  Top 0.254: R36.S C21.1
N$40
  Top 0.254: IC5.3 55.75,70.92 52.1,70.92 51.89,71.12 R15.1
N$41
  Top 0.254: R22.1 9.83,62.38 6.17,62.38 LED12.A
N$44
  Top 0.254: IC1.13 35.23,60.76 24.66,60.76 20.6,64.82 18.97,64.82 15.72,61.57 12.47,61.57 3.53,52.63 3.53,52.22 LED2.K
N$45
  Top 0.254: R21.1 9.83,52.22 6.17,52.22 LED2.A
N$46  (via drill 0.61)
  Top 0.254: v29.74,50.6 27.91,48.77 10.85,48.77 10.44,48.36 8.61,48.36 v8.2,48.77
  Bottom 0.254: v29.74,50.6 30.56,51.41 30.56,56.29 IC1.12 | v8.2,48.77 3.33,43.89 3.33,42.06 LED10.K
N$47
  Top 0.254: R27.2 9.83,72.54 6.17,72.54 LED11.A
N$48
  Top 0.254: R28.2 9.83,42.06 6.17,42.06 LED10.A
N$49
  Bottom 0.254: IC1.2 41.33,67.06 41.33,67.67 42.75,69.09 42.75,72.34 R31.S
N$50
  Bottom 0.254: IC1.3 37.67,66.04 37.46,66.24 37.46,68.07 34.01,71.53 34.01,72.34 R32.S
N$51  (via drill 0.61)
  Top 0.254: v28.52,70.31 26.49,72.34 25.07,72.34 R33.S
  Bottom 0.254: v28.52,70.31 28.52,70.1 32.59,66.04 IC1.5
N$52
  Top 0.254: IC1.4 35.23,65.43 37.06,63.6 40.31,63.6 42.75,66.04 IC1.1
  Bottom 0.254: IC1.4 35.23,66.65 29.54,72.34 29.54,80.06 16.13,80.06 13.69,77.62 R34.E
N$53
  Top 0.254: R31.A 45.39,77.42 42.75,74.78 39.7,74.78 37.06,77.42 36.65,77.42 R32.A 33.81,74.78 30.76,74.78 28.12,77.42 27.71,77.42 R33.A | R24.1 16.33,66.04 18.77,68.48 25.88,68.48 27.51,66.85 27.51,66.04 IC1.7
  Bottom 0.254: R24.1 16.13,66.04 13.69,63.6 13.69,59.74 C8.1 | IC1.7 27.51,66.04 27.51,77.42 R33.A
PGC
  Bottom 0.254: PICKIT2.5 20.4,60.96 22.02,59.33 22.02,57.71 22.63,57.1 22.63,45.72 IC6.27
PGD
  Bottom 0.254: IC6.28 21.01,46.74 21.01,47.35 21.82,48.16 21.82,50.19 22.02,50.39 22.02,56.69 20.4,58.32 19.99,58.32 PICKIT2.4
PLLACQ  (via drill 0.61)
  Top 0.254: U1A.7 33.6,19.51 33.6,23.98 32.79,23.98 U1.7 32.79,24.18 32.79,24.79 34.42,26.42 36.45,26.42 v37.46,27.43 | v37.67,34.75 v44.37,34.75
  Bottom 0.254: IC6.11 45.39,35.76 v44.37,34.75 | v37.67,34.75 37.31,34.39 37.31,27.58 v37.46,27.43
PTT
  Top 0.254: 31.98,31.75 31.98,32.87 27.56,35.66 25.07,37.39 IC6.3 | 31.98,31.75 31.98,29.87 33.4,28.45 64.08,28.45 65.71,26.82 R19.1 | 31.98,31.75 28.12,31.75 26.09,33.53 10.44,33.53 9.83,34.14 R18.2
RCFB
  Top 0.254: R17.2 C14.2 | U1A.10 31.57,19.3 31.57,16.61 25.17,16.61 25.12,22.76 25.12,24.23 25.07,24.23 U1.10
  Bottom 0.254: U1.10 R17.2
RX-232
  Top 0.254: IC6.18 45.39,50.6 43.97,52.02 SERIAL.1
RXCLOCK
  Top 0.254: U1A.21 35.64,13.41 35.64,12.8 37.52,11.18 38.68,11.18 40.31,9.55 U1.21
  Bottom 0.254: IC6.21 37.77,43.18 36.5,41.91 36.5,15.84 38.44,13.9 38.86,13.9 40.31,12.45 U1.21
RXDATA  (via drill 0.61)
  Top 0.254: v27.51,41.45 v30.15,41.45 | U1A.20 34.98,13.59 34.98,11.18 36.75,11.18 37.77,10.41 U1.20
  Bottom 0.254: v30.15,41.45 IC6.24 | v27.51,41.45 26.09,40.03 26.09,36.58 26.9,35.76 26.9,26.42 26.34,25.6 26.34,11.68 37.77,11.68 U1.20
RXDATA/SPKR
  Top 0.254: X1.5 78.31,42.27 75.46,39.42 65.71,39.42 R1.E
  Bottom 0.254: X2.3 74.45,19.1 69.77,23.77 69.77,28.65 68.76,29.67 68.76,35.56 65.71,38.61 R1.E
RXDCACQ  (via drill 0.61)
  Top 0.254: v34.62,18.09 34.42,18.09 34.42,19.3 U1A.6 | v35.43,35.76 47.83,35.76 47.83,38 IC6.12
  Bottom 0.254: v34.62,18.09 35.23,18.69 U1.6 35.48,24.38 35.48,35.71 v35.43,35.76
RXHOLD  (via drill 0.61)
  Top 0.254: U1A.5 35.03,19.51 35.03,21.74 36.04,21.74 37.67,23.37 37.67,23.98 U1.5 37.87,24.18 37.87,24.79 39.5,26.42 41.12,26.42 v41.33,26.62
  Bottom 0.254: v41.33,26.62 45.8,31.09 45.8,32.92 49.45,36.58 49.45,36.98 50.47,38 IC6.13
RXSIGIN  (via drill 0.61)
  Top 0.254: U1A.11 31.09,19.48 31.09,21.13 28.52,21.13 26.34,23.57 26.34,26.42 24.26,26.42 22.84,27.84 22.63,27.84 R17.1 | U1.11 22.43,24.18 22.43,27.84 R17.1 | v26.49,42.47 36.25,42.47 36.25,46.94 43.36,54.05 47.22,54.05 52.3,59.13 72.42,59.13 72.42,66.85 70.79,68.48 R2.2 | R17.1 22.43,28.04 22.43,31.7 C14.1
  Bottom 0.254: v26.49,42.47 24.05,40.03 24.05,36.58 22.63,35.15 22.63,31.9 C14.1
RXSN  (via drill 0.61)
  Top 0.254: U1.23 45.39,9.55 45.44,12.55 37.67,12.55 36.86,13.11 36.86,13.41 U1A.23 36.86,13.61 36.86,15.04 36.04,15.85 35.64,15.85 v33.4,18.09
  Bottom 0.254: 28.93,30.48 31.98,27.43 31.98,27.23 34.21,24.99 34.21,22.55 33.4,21.74 v33.4,18.09 | 28.93,30.48 28.93,30.68 30.56,32.31 30.56,33.73 29.13,35.15 29.13,41.05 26.09,44.09 26.09,47.75 24.66,49.17 24.66,55.88 22.63,57.91 22.63,65.43 18.16,65.43 16.33,63.6 R24.2 | 28.93,30.48 R14.1
TRXPTT
  Top 0.254: Q2.3 64.49,22.96 68.15,22.96 D2.C 68.35,22.96 73.43,22.96 X2.4
  Bottom 0.254: X1.3 78.31,48.97 72.62,43.28 72.62,35.15 69.37,31.9 69.37,29.87 72.82,26.42 72.82,23.77 74.45,22.15 74.45,21.95 X2.4
TX-232
  Bottom 0.254: IC6.17 48.03,45.72 48.23,45.92 48.23,50.8 49.05,51.61 49.05,52.02 SERIAL.3
TX/SN
  Top 0.254: R14.2 28.73,33.12 26.29,35.05 24.97,35.05 22.63,37.39 22.63,38 IC6.2
  Bottom 0.254: C1.1 20.6,31.09 20.6,34.95 22.22,36.58 22.22,36.78 22.43,36.98 22.43,38 IC6.2
TXCLOCK
  Top 0.254: U1A.22 36.23,12.95 36.5,12.7 37.52,11.94 42.85,11.94 U1.22
  Bottom 0.254: IC6.22 35.23,46.74 36.5,48.01 39.04,48.01 39.04,33.78 38.02,32.77 38.02,28.19 39.29,26.92 39.29,15.75 41.33,13.72 42.85,13.72 U1.22
TXDATA  (via drill 0.61)
  Top 0.254: v34.42,15.85 34.42,13.61 U1A.19 34.28,12.7 34.21,12.7 34.21,10.67 35.23,10.67 U1.19 | v31.57,25.81 v31.57,29.06
  Bottom 0.254: v34.42,15.85 31.57,18.69 v31.57,25.81 | v31.57,29.06 31.98,29.46 31.98,33.73 35.23,36.98 IC6.7
TXDATA/MIC
  Top 0.254: X1.1 78.31,47.14 78.11,47.35 69.98,47.35 67.13,50.19 64.29,50.19 62.66,48.56 61.44,48.56 61.24,48.36 60.63,48.36 C21.2
  Bottom 0.254: C21.2 60.63,47.75 57.58,44.7 57.58,37.39 60.63,34.34 R8.1 60.63,34.14 67.34,27.43 67.34,26.01 66.52,25.2 66.52,21.54 74.45,13.61 X2.1
TXOUT
  Top 0.254: U1A.16 32.38,13.41 32.38,11.99 30.96,11.99 30.15,11.18 29.34,11.18 27.71,9.55 27.71,8.94 U1.16
  Bottom 0.254: R6.1 30.15,3.86 27.91,6.1 27.91,7.52 27.71,7.72 27.71,8.74 U1.16
USB+
  Top 0.254: IC6.16 50.47,50.6 58.19,50.6 60.22,52.63 63.07,52.63 64.08,51.61 67.34,51.61 78.51,62.79 78.51,63.4 J1.D+
USB-  (via drill 0.61)
  Top 0.254: v67.13,46.33 53.72,46.33 53.11,45.72 IC6.15
  Bottom 0.254: v67.13,46.33 68.96,48.16 68.96,55.27 76.48,62.79 76.48,63.4 J1.D-
VBIAS  (via drill 0.61)
  Top 0.254: U1A.9 32.38,19.51 32.38,21.74 29.34,21.74 27.71,23.37 27.71,23.98 U1.9 27.51,24.18 27.51,28.85 29.54,28.85 v30.96,30.28 | C6.1 39.09,52.22 46,59.13 46,60.76 46.41,60.76 49.05,63.4 51.69,63.4 R5.2
  Bottom 0.254: R5.2 51.89,63.6 51.89,68.48 R15.2 | v30.96,30.28 31.42,30.73 31.42,39.62 33.96,42.67 33.96,46.94 38.89,51.61 38.89,52.02 C6.1
VCC
  Top 0.254: 42.75,24.18 40.31,24.18 U1.4 40.31,23.98 38.68,22.35 37.46,22.35 35.59,20.47 U1A.4 U1A.3 | 42.85,24.18 42.75,24.18 | 42.75,24.18 U1.3 42.85,24.18 | 42.85,24.18 44.58,26.42 50.67,26.42 51.69,25.4 R13.1 | 38.48,14.43 37.67,13.61 U1A.24 | 38.48,14.43 38.48,17.74 36.7,17.74 36.23,18.2 U1A.3 | 36.25,19.3 U1A.3 | 38.48,14.43 47.83,14.43 47.83,8.94 U1.24 | R20.2 9.83,13.82 14.91,13.82 C5.1 | U1A.15 31.57,13.61 31.57,14.02 31.98,14.43 32.99,14.43 32.99,13.61 U1A.17 32.99,13.41 32.99,11.38 31.98,11.38 30.15,9.55 U1.17 30.15,8.13 28.52,6.5 27.3,6.5 25.07,8.74 U1.15 | C11.1 73.84,74.17 71.4,74.17 69.37,76.2 PWR.2 | PICKIT2.2 19.99,53.24 25.27,53.24 26.29,52.22 R25.1 26.49,52.22 26.7,52.22 28.73,54.25 40.31,54.25 IC1.15 40.31,58.52 42.75,58.52 IC1.16 49.66,65.23 58.8,65.23 63.07,60.96 IC5.8 | R12.1 16.13,44.3 9.83,44.3 R28.1
  Bottom 0.254: 36.45,5.08 35.03,6.5 30.15,6.5 U1.17 | 36.45,5.08 37.67,3.86 C17.2 | C5.1 14.91,13.82 25.07,13.82 U1.15 | 36.45,5.08 36.45,5.69 47.83,5.69 47.83,8.74 U1.24 | IC5.8 63.27,60.96 66.52,64.21 66.52,72.95 69.37,75.79 69.37,76.2 PWR.2 | IC1.15 40.31,57.91 40.92,57.3 40.92,47.95 40.72,47.75 40.72,46.13 IC6.20 40.31,43.89 41.33,42.88 41.33,31.7 40.31,30.68 U1.4 | R27.1 9.83,69.7 9.63,69.49 9.63,65.02 9.83,64.82 R22.2 9.83,64.62 8.2,62.99 8.2,51.41 9.83,49.78 R21.2 9.83,49.38 9.63,49.17 9.63,44.7 9.83,44.5 R28.1 | PICKIT2.2 19.99,53.24 16.33,49.58 16.33,44.5 R12.1
VPP
  Top 0.254: 16.33,38.46 16.94,38.46 17.14,38.41 19.79,38.41 19.99,38.2 IC6.1 | 16.33,38.46 16.33,41.86 R12.2 | 16.33,38.46 PROG.2
  Bottom 0.254: PICKIT2.1 17.96,48.77 17.96,43.89 16.33,42.27 16.33,42.06 R12.2

### Text on the board
tNames: NQSMHS V3 | DCOS | LOW | MED | HIGH | www.gmskhotspot.com | DCOS | HIGH | NI2O 04/2014 | TX | MED | RX | LOW | PTT | COS | PWR